# EAGLE design proto (EAGLE 6.1)
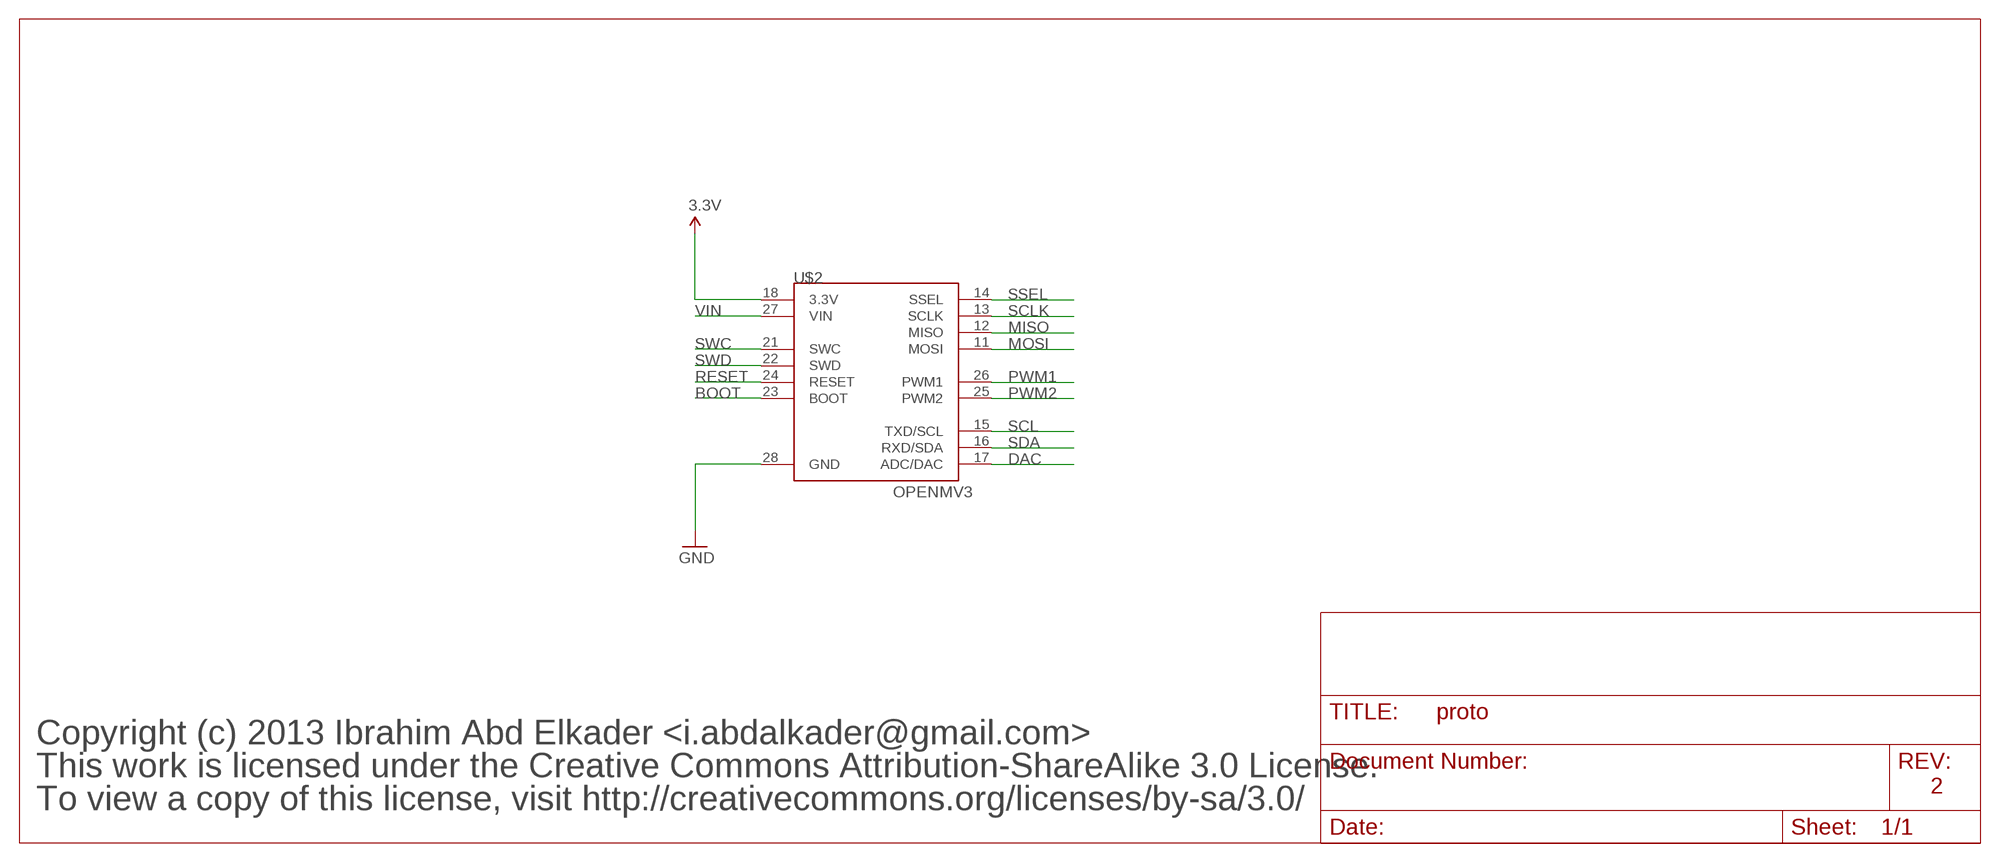
[diagram p0: schematic, sheet 1]

## Parts
U$2  OPENMV3  [OPENMV3]

## Nets
3.3V: U$2.18(3.3V)
BOOT: U$2.23(BOOT)
DAC: U$2.17(ADC/DAC)
GND: U$2.28(GND)
MISO: U$2.12(MISO)
MOSI: U$2.11(MOSI)
PWM1: U$2.26(PWM1)
PWM2: U$2.25(PWM2)
RESET: U$2.24(RESET)
SCL: U$2.15(TXD/SCL)
SCLK: U$2.13(SCLK)
SDA: U$2.16(RXD/SDA)
SSEL: U$2.14(SSEL)
SWC: U$2.21(SWC)
SWD: U$2.22(SWD)
VIN: U$2.27(VIN)

## Notes on the sheet
- Copyright (c) 2013 Ibrahim Abd Elkader <i.abdalkader@gmail.com>
- This work is licensed under the Creative Commons Attribution-ShareAlike 3.0 License.
- 2
- To view a copy of this license, visit http://creativecommons.org/licenses/by-sa/3.0/

## Library data of the parts
U$2 = openmv:OPENMV3

## Net classes
1 vcc: width 1.016 mm, clearance 0.203 mm
2 antenna: width 0.363 mm, clearance 0.305 mm
3 1.8v: width 0.457 mm, clearance 0.254 mm

## Board
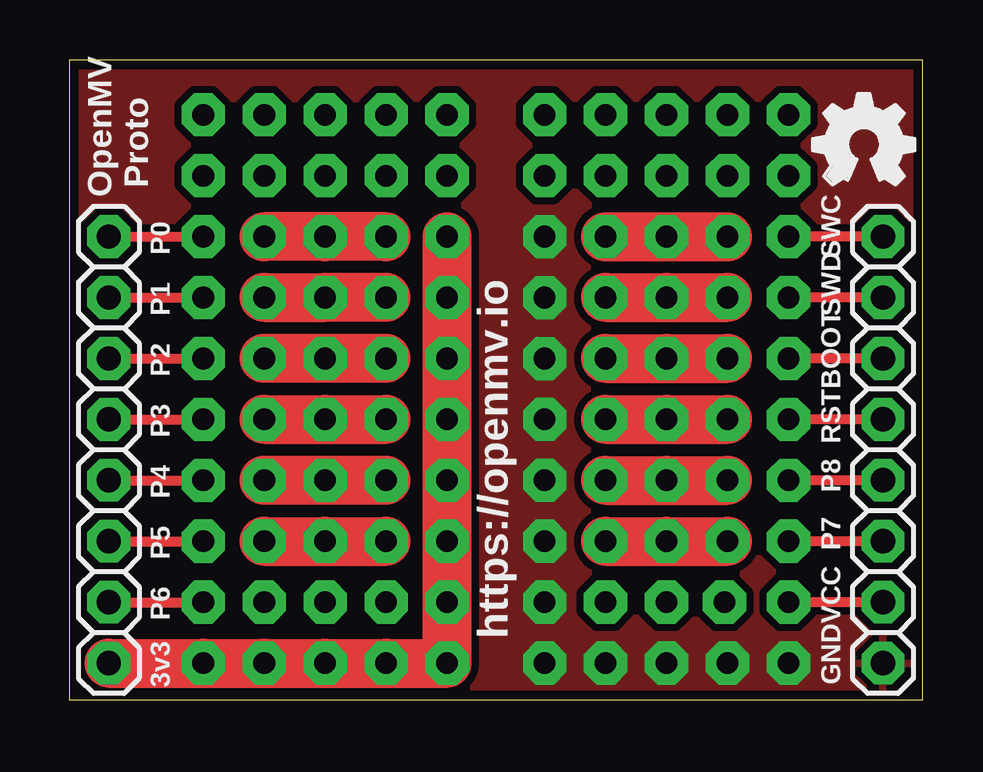
[diagram p1: board, top side]
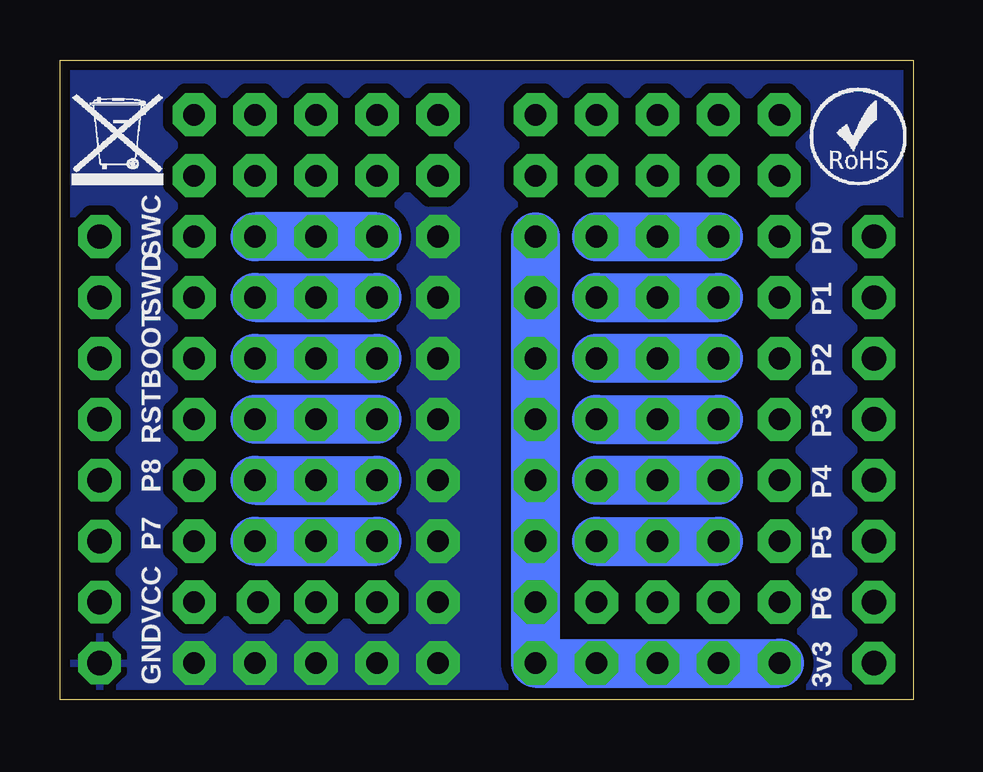
[diagram p2: board, bottom side, seen from below]

Size 35.56 x 26.67 mm. Coordinates in mm from the lower left corner, seen from the top.
Outline: 0,0 35.56,0 35.56,26.67 0,26.67 0,0
Copper layers (1*16): Top 0.0356mm / dielectric 1.5011mm / Bottom 0.0356mm
Design rules: minimum track width 6mil, minimum drill 13mil, track to track 6mil, track to pad 6mil, pad to pad 6mil, via to via 6mil, smd to smd 6mil, copper to edge 15mil, drill to drill 6mil, minimum pad ring 7mil, minimum via ring 7mil, stop-mask expansion 3mil, vias tented up to drill 30mil, thermal gap 10mil

### Footprints (pad centres in the part's own frame; a part is rotated, then mirrored left to right if it is on the bottom)
OPENMV3 = drill 1.016 pad 1.778 octagon: 11 1.651,19.304; 12 1.651,16.764; 13 1.651,14.224; 14 1.651,11.684; 15 1.651,9.144; 16 1.651,6.604; 17 1.651,4.064; 18 1.651,1.524; 21 33.909,19.304; 22 33.909,16.764; 23 33.909,14.224; 24 33.909,11.684; 25 33.909,9.144; 26 33.909,6.604; 27 33.909,4.064; 28 33.909,1.524

### Placement (x,y rotation side)
U$1  [OSHW_FILLX150_NOTEXT]  30.99,21.46 0 top
U$2  0,0 0 top
U$3  [ROHS]  4.32,21.46 0 bottom
U$4  [WEEE]  35.05,21.46 0 bottom

### Tracks (layer width: path | path; a pad name or v marks a point on that pad's centre or on a via)
3.3V  (via drill 0.9)
  Top 2.032: v15.75,19.3 v15.75,16.76 v15.75,14.22 v15.75,11.68 v15.75,9.14 v15.75,6.6 v15.75,1.52 v13.21,1.52 v10.67,1.52 v8.13,1.52 v5.59,1.52 U$2.18
  Bottom 2.032: v15.75,19.3 v15.75,6.6 v15.75,4.06 v15.75,1.52 v5.59,1.52
BOOT  (via drill 0.9)
  Top 0.406: U$2.23 v29.97,14.22
DAC  (via drill 0.9)
  Top 0.406: U$2.17 v5.59,4.06
GND  (via drill 0.9)
  other vias: 19.81,4.06 19.81,6.6 19.81,9.14 19.81,11.68 19.81,14.22 19.81,16.76 19.81,19.3 29.97,1.52 27.43,1.52 24.89,1.52 22.35,1.52 19.81,1.52
  pour Bottom (isolate 0.406, rank 2): 0,0 35.56,0 35.56,26.67 0,26.67
  pour Top (isolate 0.305, rank 2): 0,0 35.56,0 35.56,26.67 0,26.67
MISO  (via drill 0.9)
  Top 0.406: U$2.12 v5.59,16.76
MOSI  (via drill 0.9)
  Top 0.406: U$2.11 v5.59,19.3
N$5  (via drill 0.9)
  other vias: 24.89,4.06
N$11  (via drill 0.9)
  Top 2.032: v22.35,6.6 v24.89,6.6 v27.43,6.6
  Bottom 2.032: v27.43,6.6 v22.35,6.6
N$13  (via drill 0.9)
  Top 2.032: v22.35,9.14 v24.89,9.14 v27.43,9.14
  Bottom 2.032: v27.43,9.14 v22.35,9.14
N$14  (via drill 0.9)
  Top 2.032: v22.35,11.68 v24.89,11.68 v27.43,11.68
  Bottom 2.032: v22.35,11.68 v27.43,11.68
N$15  (via drill 0.9)
  Top 2.032: v22.35,14.22 v24.89,14.22 v27.43,14.22
  Bottom 2.032: v27.43,14.22 v22.35,14.22
N$16  (via drill 0.9)
  Top 2.032: v22.35,16.76 v24.89,16.76 v27.43,16.76
  Bottom 2.032: v27.43,16.76 v22.35,16.76
N$19  (via drill 0.9)
  Top 2.032: v22.35,19.3 v24.89,19.3 v27.43,19.3
  Bottom 2.032: v22.35,19.3 v27.43,19.3
N$22  (via drill 0.9)
  Top 2.032: v13.21,19.3 v10.67,19.3 v8.13,19.3
  Bottom 2.032: v13.21,19.3 v8.13,19.3
N$23  (via drill 0.9)
  Top 2.032: v13.21,16.76 v10.67,16.76 v8.13,16.76
  Bottom 2.032: v13.21,16.76 v8.13,16.76
N$24  (via drill 0.9)
  Top 2.032: v13.21,14.22 v10.67,14.22 v8.13,14.22
  Bottom 2.032: v8.13,14.22 v13.21,14.22
N$25  (via drill 0.9)
  Top 2.032: v8.13,11.68 v10.67,11.68 v13.21,11.68
  Bottom 2.032: v13.21,11.68 v8.13,11.68
N$26  (via drill 0.9)
  Top 2.032: v13.21,9.14 v10.67,9.14 v8.13,9.14
  Bottom 2.032: v8.13,9.14 v13.21,9.14
N$27  (via drill 0.9)
  Top 2.032: v8.13,6.6 v10.67,6.6 v13.21,6.6
  Bottom 2.032: v13.21,6.6 v8.13,6.6
N$28  (via drill 0.9)
  other vias: 22.35,4.06
N$29  (via drill 0.9)
  other vias: 13.21,4.06
N$30  (via drill 0.9)
  other vias: 10.67,4.06
N$31  (via drill 0.9)
  other vias: 8.13,4.06
N$43  (via drill 0.9)
  other vias: 5.59,21.84
N$44  (via drill 0.9)
  other vias: 8.13,21.84
N$45  (via drill 0.9)
  other vias: 10.67,21.84
N$46  (via drill 0.9)
  other vias: 13.21,21.84
N$47  (via drill 0.9)
  other vias: 15.75,21.84
N$48  (via drill 0.9)
  other vias: 19.81,21.84
N$49  (via drill 0.9)
  other vias: 22.35,21.84
N$50  (via drill 0.9)
  other vias: 24.89,21.84
N$51  (via drill 0.9)
  other vias: 27.43,21.84
N$52  (via drill 0.9)
  other vias: 29.97,21.84
N$60  (via drill 0.9)
  other vias: 27.3,4.06
N$61  (via drill 0.9)
  other vias: 5.59,24.38
N$62  (via drill 0.9)
  other vias: 8.13,24.38
N$63  (via drill 0.9)
  other vias: 10.67,24.38
N$64  (via drill 0.9)
  other vias: 13.21,24.38
N$65  (via drill 0.9)
  other vias: 15.75,24.38
N$66  (via drill 0.9)
  other vias: 19.81,24.38
N$67  (via drill 0.9)
  other vias: 22.35,24.38
N$68  (via drill 0.9)
  other vias: 24.89,24.38
N$70  (via drill 0.9)
  other vias: 29.97,24.38
N$71  (via drill 0.9)
  other vias: 27.43,24.38
PWM1  (via drill 0.9)
  Top 0.406: U$2.26 v29.97,6.6
PWM2  (via drill 0.9)
  Top 0.406: U$2.25 v29.97,9.14
RESET  (via drill 0.9)
  Top 0.406: U$2.24 v29.97,11.68
SCL  (via drill 0.9)
  Top 0.406: U$2.15 v5.59,9.14
SCLK  (via drill 0.9)
  Top 0.406: U$2.13 v5.59,14.22
SDA  (via drill 0.9)
  Top 0.406: U$2.16 v5.59,6.6
SSEL  (via drill 0.9)
  Top 0.406: U$2.14 v5.59,11.68
SWC  (via drill 0.9)
  Top 0.406: U$2.21 v29.97,19.3
SWD  (via drill 0.9)
  Top 0.406: U$2.22 v29.97,16.76
VIN  (via drill 0.9)
  Top 0.406: U$2.27 v29.97,4.06

### Text on the board
tPlace: OpenMV | Proto | P0 | SWC | P1 | SWD | P2 | BOOT | P3 | RST | P8 | P4 | P5 | P7 | P6 | https://openmv.io | VCC | 3v3 | GND
bPlace: P0 | SWC | P1 | SWD | P2 | BOOT | P3 | RST | P8 | P4 | P5 | P7 | P6 | VCC | 3v3 | GND